# Altium schematic sheet RS232_MAX3232.SchDoc: RS232COMMS_1
size A4; Organization: Altium Limited.; Address1: Level 3, 12a Rodborough Rd; Address2: Frenchs Forest 2086; Address3: NSW; Address4: AUSTRALIA; SheetNumber: 1; SheetTotal: 100
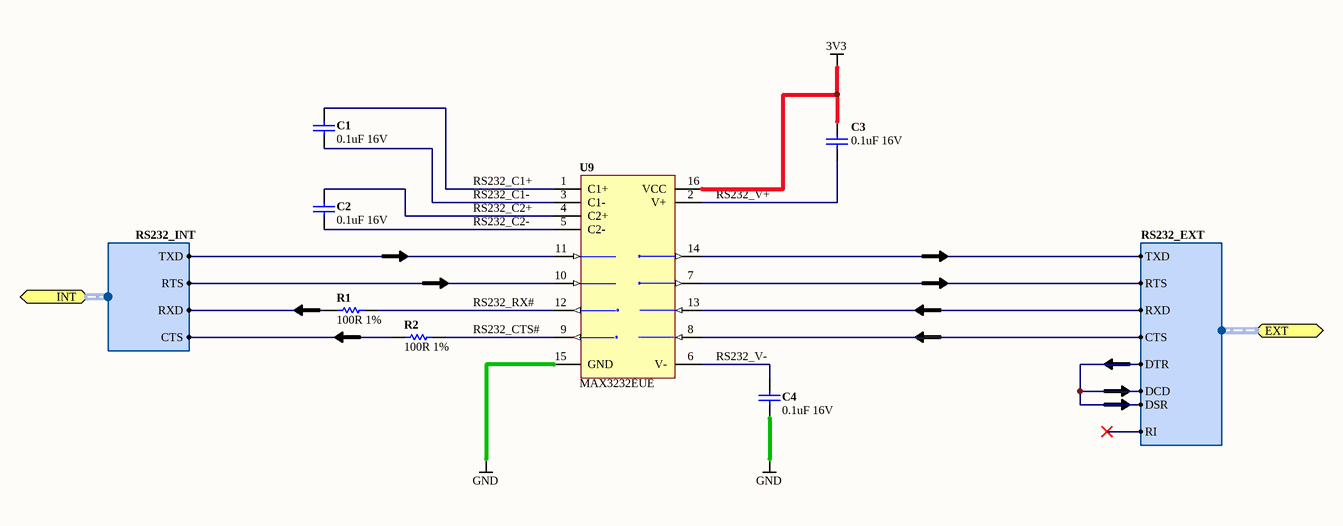
[diagram p0: RS232_MAX3232.SchDoc]

## Parts
C1  0.1uF 16V  [CAPC1005-STAR]
C2  0.1uF 16V  [CAPC1005-STAR]
C3  0.1uF 16V  [CAPC1005-STAR]
C4  0.1uF 16V  [CAPC1005-STAR]
R1  100R 1%  [RESC1005-STAR]
R2  100R 1%  [RESC1005-STAR]
U9  MAX3232EUE  [TSOP65P638-16]

## Ports
EXT (harness RS232_EXT), INT (harness RS232_INT)

## Harnesses
RS232_EXT: DCD, RXD, TXD, DTR, DSR, RTS, CTS, RI
RS232_INT: RXD, TXD, RTS, CTS

## Nets
3V3: C3.1 U9.16(VCC)
GND: C4.2 U9.15(GND)
RS232_C1+: C1.1 U9.1(C1+)
RS232_C1-: C1.2 U9.3(C1-)
RS232_C2+: C2.1 U9.4(C2+)
RS232_C2-: C2.2 U9.5(C2-)
RS232_CTS#: R2.2 U9.9(R2OUT)
RS232_RX#: R1.2 U9.12(R1OUT)
RS232_V+: C3.2 U9.2(V+)
RS232_V-: C4.1 U9.6(V-)
NetR1_1: R1.1 ; port INT.RXD
NetR2_1: R2.1 ; port INT.CTS
NetU9_7: U9.7(T2OUT) ; port EXT.RTS
NetU9_8: U9.8(R2IN) ; port EXT.CTS
NetU9_10: U9.10(T2IN) ; port INT.RTS
NetU9_11: U9.11(T1IN) ; port INT.TXD
NetU9_13: U9.13(R1IN) ; port EXT.RXD
NetU9_14: U9.14(T1OUT) ; port EXT.TXD
(unnamed): port EXT.DCD, port EXT.DTR, port EXT.DSR

## Notes on the sheet
- Sheet Title
- Project Title
- Size:
- Date:
- A4
- Assy:
- Time:
- Revision:
- Sheet
- of
- File:

## Library data of the parts
C1-C4 = D-101-0080: Capacitor, Ceramic, 0.1uF 10% 16V 0402 (1005) X7R; Polarity: Non-Polarized; Category: Capacitor; Capacitance: 0.1 uF; Dielectric: X7R; Mounting Technology: Surface Mount; Rated Voltage: 16 V; Status: Production; Technology: Ceramic; Tolerance: 10 %
R1 R2 = D-100-0131: Resistor, 100R 1% 0402 (1005); Power Rating: 63 mW; Category: Resistor; Mounting Technology: Surface Mount; Resistance: 100 R; Status: Production; Tolerance: 1 %
U9 = D-221-0002: MAX3232EUE, 3.0V to 5.5V, Low-Power, up to 1Mbps, True RS-232 Transceivers Using Four 0.1µF External Capacitors; Category: IC-Communication; Status: Production